# Altium schematic sheet Scratchpad.SchDoc (part 3 of 3)
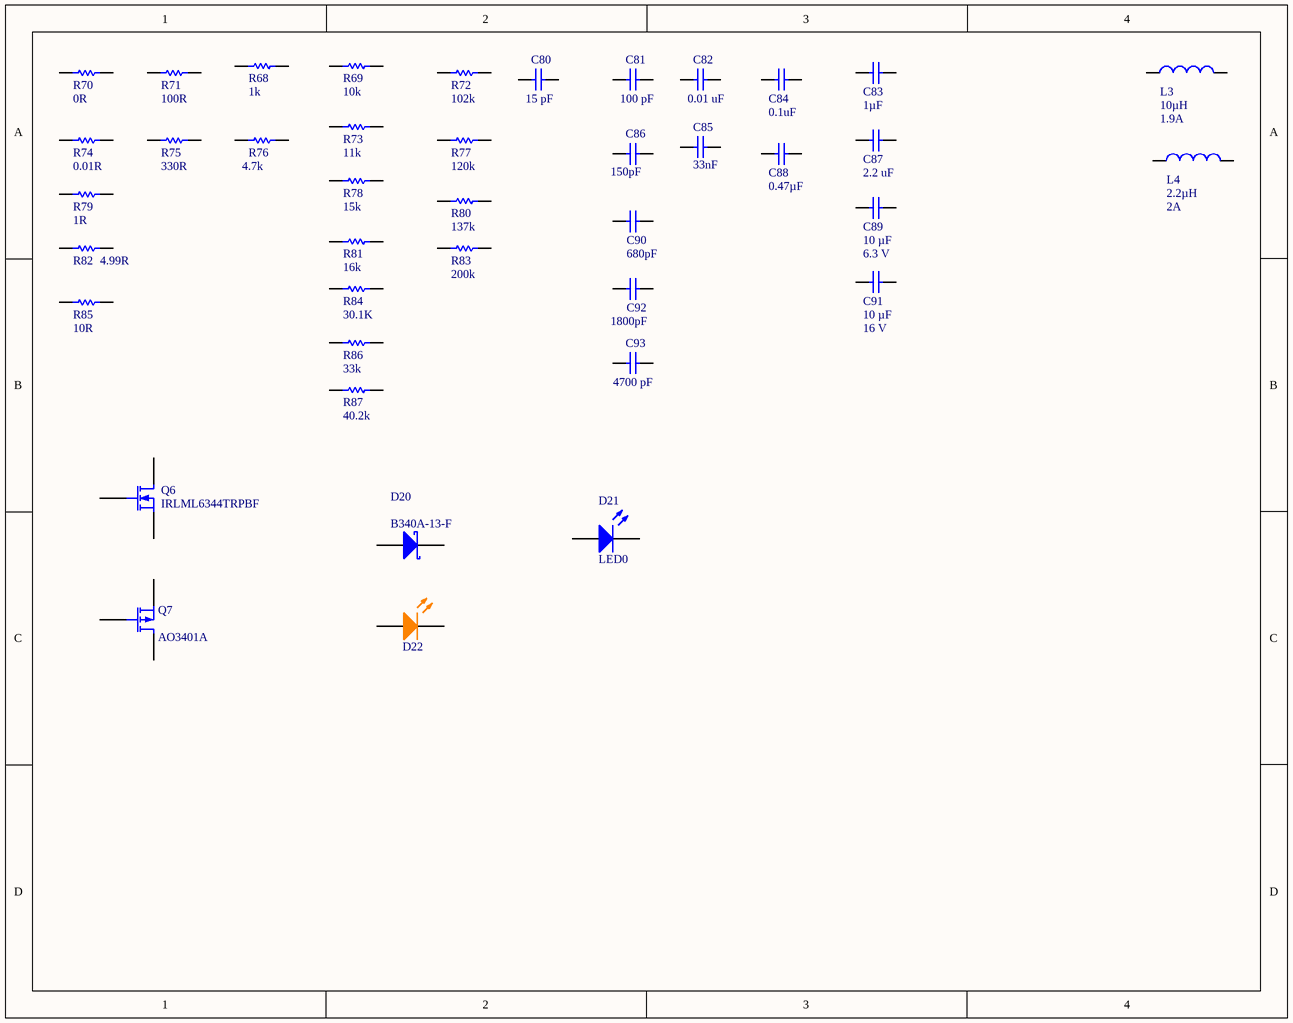
[diagram p2: Scratchpad.SchDoc]

## Library data of the parts (continued)
R78 = Res 0805: Resistor; Manufacturer: Panasonic; Manufacturer Part Number: ERJ-2RKF1502X; Description1: Res Thick Film 0402 15K Ohm 1% 0.1W(1/10W) ±100ppm/C Molded SMD Automotive Punched T/R; Tolerance: 1 %; Power Rating: 100 mW; Temperature Coefficient: 100 PPM / C; Voltage Rating: 50 V; Qualification: AEC-Q200; Unit Weight: 0.000028 oz; Supplier 1: Digi-Key; Supplier Part Number 1: P15.0KLCT-ND; Stock 1: 1770491; Pricing 1: 1=0.1, 10=0.056, 100=0.0227, 1000=0.0102, 2500=0.0089, 5000=0.0073 (USD); Product Category: Thick Film Resistors - SMD; RoHS: True; Case Code - in: 0402; Case Code - mm: 1005; Operating Temperature Range: - 55 C to + 155 C; Series: ERJ; Type: Precision Thick Film Resistors SMD; Brand: Panasonic; Height: 0.35 mm; Length: 1 mm; Package / Case: 0402 (1005 metric); Packaging: Reel; Product: Thick Film Resistors SMD; Factory Pack Quantity: 10000; Termination Style: SMD/SMT; Width: 0.5 mm; ComponentLink1URL: https://datasheet.ciiva.com/6138/aoa0000ce2-6138166.pdf; ComponentLink1Description: https://datasheet.ciiva.com/6138/aoa0000ce2-6138166.pdf; ComponentLink2URL: https://datasheet.ciiva.com/16765/70260748-16765542.pdf; ComponentLink2Description: https://datasheet.ciiva.com/16765/70260748-16765542.pdf; ComponentLink3URL: https://datasheet.ciiva.com/43467/1678782-43467414.pdf; ComponentLink3Description: https://datasheet.ciiva.com/43467/1678782-43467414.pdf; ComponentLink4URL: https://datasheet.ciiva.com/9193/aoa0000ce2-9193047.pdf; ComponentLink4Description: https://datasheet.ciiva.com/9193/aoa0000ce2-9193047.pdf; ComponentLink5URL: https://datasheet.ciiva.com/8079/426256-8079609.pdf; ComponentLink5Description: https://datasheet.ciiva.com/8079/426256-8079609.pdf; ComponentLink6URL: https://datasheet.ciiva.com/16778/70260748-16778682.pdf; ComponentLink6Description: https://datasheet.ciiva.com/16778/70260748-16778682.pdf; ComponentLink7URL: https://datasheet.ciiva.com/16371/aoa0000ce2-16371499.pdf; ComponentLink7Description: https://datasheet.ciiva.com/16371/aoa0000ce2-16371499.pdf; ComponentLink8URL: https://datasheet.ciiva.com/22687/1678782-22687068.pdf; ComponentLink8Description: https://datasheet.ciiva.com/22687/1678782-22687068.pdf; ComponentLink9URL: https://datasheet.ciiva.com/11821/0900766b80f80784-11821181.pdf; ComponentLink9Description: https://datasheet.ciiva.com/11821/0900766b80f80784-11821181.pdf; ComponentLink10URL: https://datasheet.ciiva.com/46372/1678782-46372862.pdf; ComponentLink10Description: https://datasheet.ciiva.com/46372/1678782-46372862.pdf; ComponentLink11URL: https://datasheet.ciiva.com/17211/aoa0000ce2-17211535.pdf; ComponentLink11Description: https://datasheet.ciiva.com/17211/aoa0000ce2-17211535.pdf; ComponentLink12URL: https://datasheet.ciiva.com/46372/1678782-46372863.pdf; ComponentLink12Description: https://datasheet.ciiva.com/46372/1678782-46372863.pdf
R79 = Res 0805: Resistor; Manufacturer: Panasonic; Manufacturer Part Number: ERJ-2GEJ1R0X; Description1: Res Thick Film 0402 1 Ohm 5% 0.1W(1/10W) -100ppm/C to 600ppm/C Molded SMD Automotive Punched T/R; Tolerance: 5 %; Power Rating: 100 mW; Temperature Coefficient: - 100 PPM / C, + 600 PPM / C; Voltage Rating: 50 V; Supplier 1: Digi-Key; Supplier Part Number 1: P1.0JCT-ND; Stock 1: 1263375; Pricing 1: 1=0.1, 10=0.038, 100=0.0154, 1000=0.0069, 2500=0.006, 5000=0.005 (USD); Product Category: Thick Film Resistors - SMD; RoHS: Details; Case Code - in: 0402; Case Code - mm: 1005; Operating Temperature Range: - 55 C to + 155 C; Series: ERJ; Brand: Panasonic; Height: 0.35 mm; Length: 1 mm; Package / Case: 0402 (1005 metric); Packaging: Reel; Product: Thick Film Resistors SMD; Factory Pack Quantity: 10000; Termination Style: SMD/SMT; Type: Thick Film Resistors SMD; Width: 0.5 mm; ComponentLink1URL: https://datasheet.ciiva.com/9198/aoa0000ce1-9198901.pdf; ComponentLink1Description: https://datasheet.ciiva.com/9198/aoa0000ce1-9198901.pdf; ComponentLink2URL: https://datasheet.ciiva.com/24068/aoa0000ce1-37422-24068837.pdf; ComponentLink2Description: https://datasheet.ciiva.com/24068/aoa0000ce1-37422-24068837.pdf; ComponentLink3URL: https://datasheet.ciiva.com/46377/1500035-46377671.pdf; ComponentLink3Description: https://datasheet.ciiva.com/46377/1500035-46377671.pdf; ComponentLink4URL: https://datasheet.ciiva.com/48530/aoa0000ce1-48530951.pdf; ComponentLink4Description: https://datasheet.ciiva.com/48530/aoa0000ce1-48530951.pdf; ComponentLink5URL: https://datasheet.ciiva.com/34303/1986844-34303545.pdf; ComponentLink5Description: https://datasheet.ciiva.com/34303/1986844-34303545.pdf; ComponentLink6URL: https://datasheet.ciiva.com/11821/0900766b80f806dd-11821226.pdf; ComponentLink6Description: https://datasheet.ciiva.com/11821/0900766b80f806dd-11821226.pdf; ComponentLink7URL: https://datasheet.ciiva.com/16758/70260739-16758282.pdf; ComponentLink7Description: https://datasheet.ciiva.com/16758/70260739-16758282.pdf; ComponentLink8URL: https://datasheet.ciiva.com/28547/1678796-28547147.pdf; ComponentLink8Description: https://datasheet.ciiva.com/28547/1678796-28547147.pdf; ComponentLink9URL: https://datasheet.ciiva.com/46389/1500035-46389755.pdf; ComponentLink9Description: https://datasheet.ciiva.com/46389/1500035-46389755.pdf; ComponentLink10URL: https://datasheet.ciiva.com/16772/70260739-16772860.pdf; ComponentLink10Description: https://datasheet.ciiva.com/16772/70260739-16772860.pdf; ComponentLink11URL: https://datasheet.ciiva.com/43460/1500035-43460348.pdf; ComponentLink11Description: https://datasheet.ciiva.com/43460/1500035-43460348.pdf; ComponentLink12URL: https://datasheet.ciiva.com/30245/4aoa0000ce1-30245805.pdf; ComponentLink12Description: https://datasheet.ciiva.com/30245/4aoa0000ce1-30245805.pdf; ComponentLink13URL: https://datasheet.ciiva.com/6138/1500035-6138734.pdf; ComponentLink13Description: https://datasheet.ciiva.com/6138/1500035-6138734.pdf
R80 = Res 0805: Resistor; Manufacturer: Panasonic; Manufacturer Part Number: ERJ-2RKF1373X; Description1: Resistor; Thick Film; Res 137 Kilohms; Pwr-Rtg 0.1 W; Tol 1%; SMT; 0402; Tape & Reel; EDA / CAD Models: Download from Accelerated Designs; Tolerance: ±1%; Power (Watts): 0.1W, 1/10W; Temperature Coefficient: ±100ppm/°C; Online Catalog: ERJ Series; Kits: RSM5L-ND  - RES KIT 100K-1M 1/10W 4850PCS; Other Names: ERJ-2RKF1373 ERJ2RKF1373 P137KLCT; Supplier 1: Digi-Key; Supplier Part Number 1: P137KLCT-ND; Stock 1: 309305; Pricing 1: 1=0.1, 10=0.056, 100=0.0227, 1000=0.0102, 2500=0.0089, 5000=0.0073 (USD); Standard Package: 1; Category: Resistors; Family: Chip Resistor - Surface Mount; Series: ERJ; Packaging: Cut Tape (CT); Composition: Thick Film; Features: Automotive AEC-Q200; Operating Temperature: -55°C ~ 155°C; Package / Case: 0402 (1005 Metric); Supplier Device Package: 0402; Size / Dimension: 0.039" L x 0.020" W (1.00mm x 0.50mm); Height: 0.016" (0.40mm); Number of Terminations: 2; ComponentLink1URL: https://datasheet.ciiva.com/9185/aoa0000ce2-9185782.pdf; ComponentLink1Description: https://datasheet.ciiva.com/9185/aoa0000ce2-9185782.pdf; ComponentLink2URL: https://datasheet.ciiva.com/22729/1678782-22729047.pdf; ComponentLink2Description: https://datasheet.ciiva.com/22729/1678782-22729047.pdf; ComponentLink3URL: https://datasheet.ciiva.com/16784/70260748-16784121.pdf; ComponentLink3Description: https://datasheet.ciiva.com/16784/70260748-16784121.pdf; ComponentLink4URL: https://datasheet.ciiva.com/28594/1694929-28594522.pdf; ComponentLink4Description: https://datasheet.ciiva.com/28594/1694929-28594522.pdf; ComponentLink5URL: https://datasheet.ciiva.com/22672/1678782-22672827.pdf; ComponentLink5Description: https://datasheet.ciiva.com/22672/1678782-22672827.pdf; ComponentLink6URL: https://datasheet.ciiva.com/46373/1678782-46373069.pdf; ComponentLink6Description: https://datasheet.ciiva.com/46373/1678782-46373069.pdf; ComponentLink7URL: https://datasheet.ciiva.com/24026/aoa0000ce2-24026526.pdf; ComponentLink7Description: https://datasheet.ciiva.com/24026/aoa0000ce2-24026526.pdf; ComponentLink8URL: https://datasheet.ciiva.com/46373/1678782-46373070.pdf; ComponentLink8Description: https://datasheet.ciiva.com/46373/1678782-46373070.pdf
R81 = Res 0805: Resistor; Manufacturer: Panasonic; Manufacturer Part Number: ERJ-2RKF1602X; Description1: Panasonic ERJ2RK Series Thick Film Surface Mount Fixed Resistor 0402 Case 1% 0.1W 100ppm/C; Resistor Case Style: 0402; Resistor Mounting: SMD; Resistance Tolerance: ± 1%; Power Rating: 100mW; Voltage Rating: 50V; Temperature Coefficient: ± 100ppm/°C; Resistor Element Material: Thick Film; Supplier 1: Digi-Key; Supplier Part Number 1: P16.0KLCT-ND; Stock 1: 351031; Pricing 1: 1=0.1, 10=0.056, 100=0.0227, 1000=0.0102, 2500=0.0089, 5000=0.0073 (USD); ComponentLink1URL: https://datasheet.ciiva.com/9119/aoa0000ce2-9119254.pdf; ComponentLink1Description: https://datasheet.ciiva.com/9119/aoa0000ce2-9119254.pdf; ComponentLink2URL: https://datasheet.ciiva.com/43467/1678782-43467416.pdf; ComponentLink2Description: https://datasheet.ciiva.com/43467/1678782-43467416.pdf; ComponentLink3URL: https://datasheet.ciiva.com/24070/aoa0000ce2-24070362.pdf; ComponentLink3Description: https://datasheet.ciiva.com/24070/aoa0000ce2-24070362.pdf; ComponentLink4URL: https://datasheet.ciiva.com/16761/70260748-16761564.pdf; ComponentLink4Description: https://datasheet.ciiva.com/16761/70260748-16761564.pdf; ComponentLink5URL: https://datasheet.ciiva.com/11821/0900766b80f80784-11821213.pdf; ComponentLink5Description: https://datasheet.ciiva.com/11821/0900766b80f80784-11821213.pdf; ComponentLink6URL: https://datasheet.ciiva.com/22681/1678782-22681663.pdf; ComponentLink6Description: https://datasheet.ciiva.com/22681/1678782-22681663.pdf
R82 = Res 0805: Resistor; Manufacturer: Vishay; Manufacturer Part Number: CRCW04024R99FKEDC; Supplier 1: Digi-Key; Supplier Part Number 1: 541-4085-1-ND; Stock 1: 89163; Pricing 1: 1=0.1, 10=0.026, 100=0.0104, 1000=0.0047, 2500=0.0041, 5000=0.0033 (USD); ComponentLink1URL: http://www.vishay.com/docs/28773/crcwce3.pdf; ComponentLink1Description: http://www.vishay.com/docs/28773/crcwce3.pdf
R83 = Res 0805: Resistor; Manufacturer: Panasonic; Manufacturer Part Number: ERJ-2RKF2003X; Description1: Res Thick Film 0402 200K Ohm 1% 0.1W(1/10W) ±100ppm/C Molded SMD Automotive T/R; Rated Power: 0.1 W; Tolerance (%): ±1 %; Temp Coefficient: ±100 ppm/°C; Supplier 1: Digi-Key; Supplier Part Number 1: P200KLCT-ND; Stock 1: 1535285; Pricing 1: 1=0.1, 10=0.056, 100=0.0227, 1000=0.0102, 2500=0.0089, 5000=0.0073 (USD); Size Code: 0402; ComponentLink1URL: https://datasheet.ciiva.com/5868/426256-5868117.pdf; ComponentLink1Description: https://datasheet.ciiva.com/5868/426256-5868117.pdf; ComponentLink2URL: https://datasheet.ciiva.com/24073/aoa0000ce2-24073141.pdf; ComponentLink2Description: https://datasheet.ciiva.com/24073/aoa0000ce2-24073141.pdf; ComponentLink3URL: https://datasheet.ciiva.com/46387/426256-46387157.pdf; ComponentLink3Description: https://datasheet.ciiva.com/46387/426256-46387157.pdf; ComponentLink4URL: https://datasheet.ciiva.com/11821/0900766b80f80784-11821224.pdf; ComponentLink4Description: https://datasheet.ciiva.com/11821/0900766b80f80784-11821224.pdf; ComponentLink5URL: https://datasheet.ciiva.com/48531/aoa0000ce2-48531064.pdf; ComponentLink5Description: https://datasheet.ciiva.com/48531/aoa0000ce2-48531064.pdf; ComponentLink6URL: https://datasheet.ciiva.com/28675/1678782-28675803.pdf; ComponentLink6Description: https://datasheet.ciiva.com/28675/1678782-28675803.pdf; ComponentLink7URL: https://datasheet.ciiva.com/16775/70260748-16775805.pdf; ComponentLink7Description: https://datasheet.ciiva.com/16775/70260748-16775805.pdf; ComponentLink8URL: https://datasheet.ciiva.com/46374/426256-46374221.pdf; ComponentLink8Description: https://datasheet.ciiva.com/46374/426256-46374221.pdf; ComponentLink9URL: https://datasheet.ciiva.com/16759/70260748-16759806.pdf; ComponentLink9Description: https://datasheet.ciiva.com/16759/70260748-16759806.pdf
R84 = Res 0805: Resistor; Manufacturer: Panasonic; Manufacturer Part Number: ERJ-2RKF3012X; Description1: PANASONIC ELECTRONIC COMPONENTS         ERJ2RKF3012X             SMD Chip Resistor, Thick Film, 30.1 kohm, 50 V, 0402 [1005 Metric], 100 mW,  1%, ERJ2R Series; Rated Power: 0.1 W; Tolerance (%): ±1 %; Temp Coefficient: ±100 ppm/°C; Working Voltage-Nom: 50 V; Overload Voltage - Max: 100 V; No. of Terminations: 2; Supplier 1: Digi-Key; Supplier Part Number 1: P30.1KLCT-ND; Stock 1: 680939; Pricing 1: 1=0.1, 10=0.056, 100=0.0227, 1000=0.0102, 2500=0.0089, 5000=0.0073 (USD); Technology: Thick Film; Operating Temp Range: -55 to +155 °C; Case Size: 0402 (1005 Metric); Dimension: 1 x 0.5 mm; Height - Max: 0.4 mm; ComponentLink1URL: https://datasheet.ciiva.com/16780/70260748-16780293.pdf; ComponentLink1Description: https://datasheet.ciiva.com/16780/70260748-16780293.pdf; ComponentLink2URL: https://datasheet.ciiva.com/28563/1678782-28563413.pdf; ComponentLink2Description: https://datasheet.ciiva.com/28563/1678782-28563413.pdf; ComponentLink3URL: https://datasheet.ciiva.com/30108/aoa0000ce2-30108661.pdf; ComponentLink3Description: https://datasheet.ciiva.com/30108/aoa0000ce2-30108661.pdf; ComponentLink4URL: https://datasheet.ciiva.com/9190/aoa0000ce2-9190840.pdf; ComponentLink4Description: https://datasheet.ciiva.com/9190/aoa0000ce2-9190840.pdf; ComponentLink5URL: https://datasheet.ciiva.com/28695/1678782-28695771.pdf; ComponentLink5Description: https://datasheet.ciiva.com/28695/1678782-28695771.pdf; ComponentLink6URL: https://datasheet.ciiva.com/46389/426256-46389467.pdf; ComponentLink6Description: https://datasheet.ciiva.com/46389/426256-46389467.pdf; ComponentLink7URL: https://datasheet.ciiva.com/24025/aoa0000ce2-24025263.pdf; ComponentLink7Description: https://datasheet.ciiva.com/24025/aoa0000ce2-24025263.pdf
R85 = Res 0805: Resistor; Manufacturer: Panasonic; Manufacturer Part Number: ERJ-2RKF10R0X; Description1: Res Thick Film 0402 10 Ohm 1% 0.1W(1/10W) ±100ppm/C Molded SMD Automotive Punched T/R; Rated Power: 0.1 W; Tolerance (%): ±1 %; Temp Coefficient: ±100 ppm/°C; Supplier 1: Digi-Key; Supplier Part Number 1: P10.0LCT-ND; Stock 1: 3489054; Pricing 1: 1=0.1, 10=0.056, 100=0.0227, 1000=0.0102, 2500=0.0089, 5000=0.0073 (USD); Size Code: 0402; ComponentLink1URL: https://datasheet.ciiva.com/11821/0900766b80f80784-11821168.pdf; ComponentLink1Description: https://datasheet.ciiva.com/11821/0900766b80f80784-11821168.pdf; ComponentLink2URL: https://datasheet.ciiva.com/7802/aoa0000ce2-7802405.pdf; ComponentLink2Description: https://datasheet.ciiva.com/7802/aoa0000ce2-7802405.pdf; ComponentLink3URL: https://datasheet.ciiva.com/16773/70260748-16773366.pdf; ComponentLink3Description: https://datasheet.ciiva.com/16773/70260748-16773366.pdf; ComponentLink4URL: https://datasheet.ciiva.com/43467/1678782-43467127.pdf; ComponentLink4Description: https://datasheet.ciiva.com/43467/1678782-43467127.pdf; ComponentLink5URL: https://datasheet.ciiva.com/9194/aoa0000ce2-9194120.pdf; ComponentLink5Description: https://datasheet.ciiva.com/9194/aoa0000ce2-9194120.pdf; ComponentLink6URL: https://datasheet.ciiva.com/30218/aoa0000ce2-30218536.pdf; ComponentLink6Description: https://datasheet.ciiva.com/30218/aoa0000ce2-30218536.pdf; ComponentLink7URL: https://datasheet.ciiva.com/17212/aoa0000ce2-17212057.pdf; ComponentLink7Description: https://datasheet.ciiva.com/17212/aoa0000ce2-17212057.pdf; ComponentLink8URL: https://datasheet.ciiva.com/24071/aoa0000ce2-24071514.pdf; ComponentLink8Description: https://datasheet.ciiva.com/24071/aoa0000ce2-24071514.pdf; ComponentLink9URL: https://datasheet.ciiva.com/27055/1987054-27055644.pdf; ComponentLink9Description: https://datasheet.ciiva.com/27055/1987054-27055644.pdf; ComponentLink10URL: https://datasheet.ciiva.com/6082/aoa0000ce2-6082046.pdf; ComponentLink10Description: https://datasheet.ciiva.com/6082/aoa0000ce2-6082046.pdf; ComponentLink11URL: https://datasheet.ciiva.com/22668/1678782-22668302.pdf; ComponentLink11Description: https://datasheet.ciiva.com/22668/1678782-22668302.pdf
R86 = Res 0805: Resistor; Manufacturer: Samsung; Manufacturer Part Number: RC1005F333CS; Description1: Res Thick Film 0402 33K Ohm 1% 1/16W ±100ppm/C Molded SMD T/R; Tolerance: 1 %; Power Rating: 1/16 W; Case Style: Molded; Temperature Coefficient: ±100 ppm/°C; Rad Hard: No; Lead Finish: Tin; Supplier 1: Digi-Key; Supplier Part Number 1: 1276-3461-1-ND; Stock 1: 453875; Pricing 1: 1=0.1, 10=0.021, 100=0.0087, 1000=0.0039, 2500=0.0034, 5000=0.0028 (USD); Case Size: 0402; Packaging: Tape & Reel; Type: Thick Film; Operating Temperature: -55 to 155 °C; ComponentLink1URL: http://components.arrow.com/part/dataview/0323_06900084; ComponentLink1Description: http://components.arrow.com/part/dataview/0323_06900084; ComponentLink2URL: http://www.samsungsem.com/kr/support/product-search/chip-resistor/RC1005F333CS.jsp; ComponentLink2Description: http://www.samsungsem.com/kr/support/product-search/chip-resistor/RC1005F333CS.jsp; ComponentLink3URL: http://components.arrow.com/part/dataview/51978774S9968740N4139; ComponentLink3Description: http://components.arrow.com/part/dataview/51978774S9968740N4139; ComponentLink4URL: http://www.samsungsem.com/servlet/FileDownload?type=spec&file=RC1005F9090CS.pdf; ComponentLink4Description: http://www.samsungsem.com/servlet/FileDownload?type=spec&file=RC1005F9090CS.pdf
R87 = Res 0805: Resistor; Manufacturer: Panasonic; Manufacturer Part Number: ERJ-2RKF4022X; Description1: Res Thick Film 0402 40.2K Ohm 1% 0.1W(1/10W) ±100ppm/C Molded SMD Automotive T/R; Resistor Element Type: Thick Film; Product Range: PANASONIC - ERJ Series; Power Rating: 100mW; Resistance Tolerance: ± 1%; Resistor Case Style: 0402 [1005 Metric]; Temperature Coefficient: ± 100ppm/°C; Voltage Rating: 50V; SVHC: Diboron trioxide (19-Dec-2012); Resistor Mounting: SMD; SVHC (Secondary): Lead monoxide (lead oxide) (19-Dec-2012); Supplier 1: Digi-Key; Supplier Part Number 1: P40.2KLCT-ND; Stock 1: 987602; Pricing 1: 1=0.1, 10=0.056, 100=0.0227, 1000=0.0102, 2500=0.0089, 5000=0.0073 (USD); Resistor Element Material: Thick Film; Packaging: Cut Tape; MSL: (Not Applicable); ComponentLink1URL: https://datasheet.ciiva.com/6159/426256-6159589.pdf; ComponentLink1Description: https://datasheet.ciiva.com/6159/426256-6159589.pdf; ComponentLink2URL: https://datasheet.ciiva.com/16786/70260748-16786006.pdf; ComponentLink2Description: https://datasheet.ciiva.com/16786/70260748-16786006.pdf; ComponentLink3URL: https://datasheet.ciiva.com/27055/1987281-27055654.pdf; ComponentLink3Description: https://datasheet.ciiva.com/27055/1987281-27055654.pdf; ComponentLink4URL: https://datasheet.ciiva.com/28693/1678782-28693542.pdf; ComponentLink4Description: https://datasheet.ciiva.com/28693/1678782-28693542.pdf; ComponentLink5URL: https://datasheet.ciiva.com/16771/70260748-16771239.pdf; ComponentLink5Description: https://datasheet.ciiva.com/16771/70260748-16771239.pdf; ComponentLink6URL: https://datasheet.ciiva.com/9189/aoa0000ce2-9189864.pdf; ComponentLink6Description: https://datasheet.ciiva.com/9189/aoa0000ce2-9189864.pdf; ComponentLink7URL: https://datasheet.ciiva.com/43460/426256-43460328.pdf; ComponentLink7Description: https://datasheet.ciiva.com/43460/426256-43460328.pdf; ComponentLink8URL: https://datasheet.ciiva.com/46377/426256-46377274.pdf; ComponentLink8Description: https://datasheet.ciiva.com/46377/426256-46377274.pdf; ComponentLink9URL: https://datasheet.ciiva.com/24160/aoa0000ce2-24160028.pdf; ComponentLink9Description: https://datasheet.ciiva.com/24160/aoa0000ce2-24160028.pdf